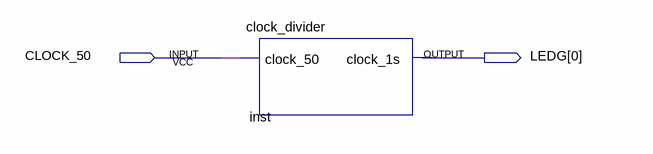
[diagram p0: schematic sheet]
// Quartus schematic clock_divider_test.bdf as structural Verilog: 1 symbols, 2 pins
module clock_divider_test (
  input  CLOCK_50,
  output [0:0] LEDG
);

  clock_divider inst (.clock_50(CLOCK_50), .clock_1s(LEDG[0]));
endmodule
